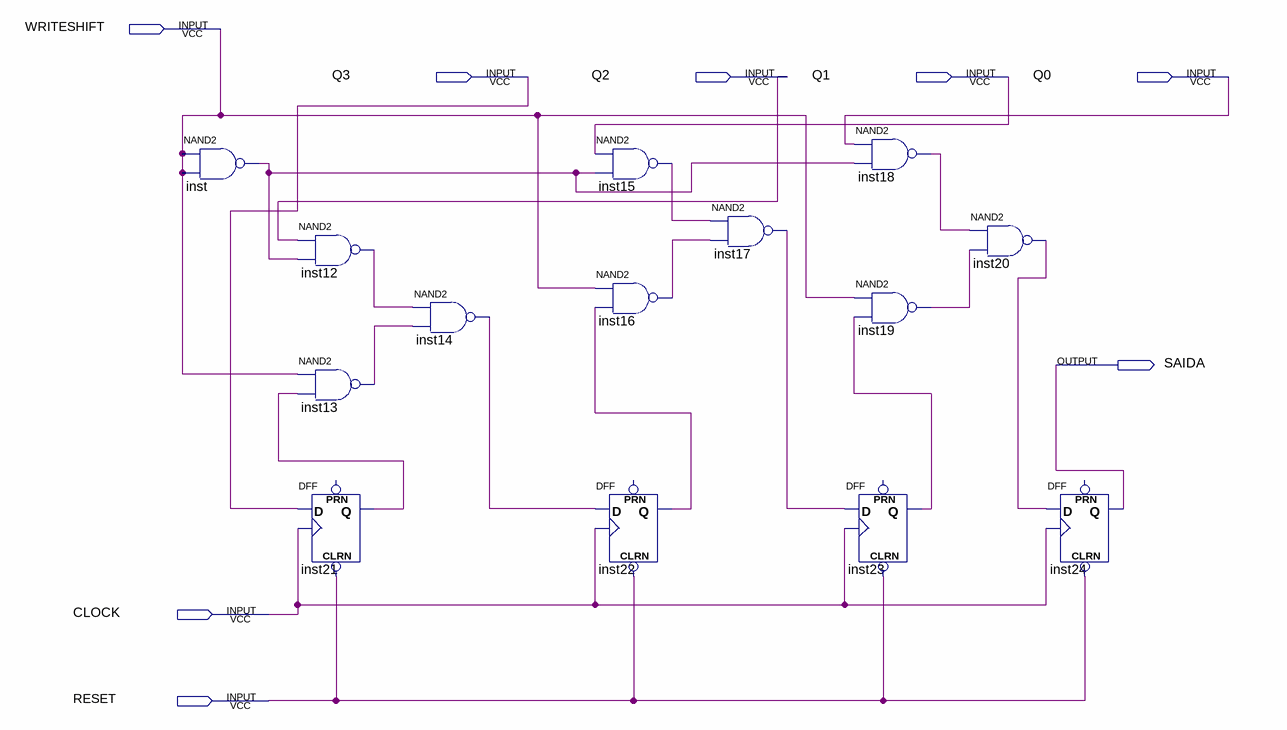
[diagram p0: schematic sheet]
// Quartus schematic ex3.bdf as structural Verilog: 14 symbols, 8 pins
module ex3 (
  input  WRITESHIFT,
  input  Q3,
  input  Q2,
  input  Q1,
  input  Q0,
  input  CLOCK,
  input  RESET,
  output SAIDA
);

  wire inst12_out, inst13_out, inst14_out, inst15_out, inst16_out, inst17_out, inst18_out, inst19_out,
       inst20_out, inst21_q, inst22_q, inst23_q, inst_out;

  nand inst (inst_out, WRITESHIFT, WRITESHIFT);
  nand inst12 (inst12_out, Q2, inst_out);
  nand inst13 (inst13_out, WRITESHIFT, inst21_q);
  DFF inst21 (.CLRN(RESET), .CLK(CLOCK), .D(Q3), .Q(inst21_q));  // open: PRN
  nand inst14 (inst14_out, inst12_out, inst13_out);
  nand inst15 (inst15_out, Q1, inst_out);
  nand inst16 (inst16_out, WRITESHIFT, inst22_q);
  DFF inst22 (.CLRN(RESET), .CLK(CLOCK), .D(inst14_out), .Q(inst22_q));  // open: PRN
  nand inst17 (inst17_out, inst15_out, inst16_out);
  nand inst18 (inst18_out, Q0, inst_out);
  nand inst19 (inst19_out, WRITESHIFT, inst23_q);
  DFF inst23 (.CLRN(RESET), .CLK(CLOCK), .D(inst17_out), .Q(inst23_q));  // open: PRN
  nand inst20 (inst20_out, inst18_out, inst19_out);
  DFF inst24 (.CLRN(RESET), .CLK(CLOCK), .D(inst20_out), .Q(SAIDA));  // open: PRN
endmodule
